# EAGLE design BMSV1.0 (EAGLE 9.1.3)

## Sheet 1 of 3
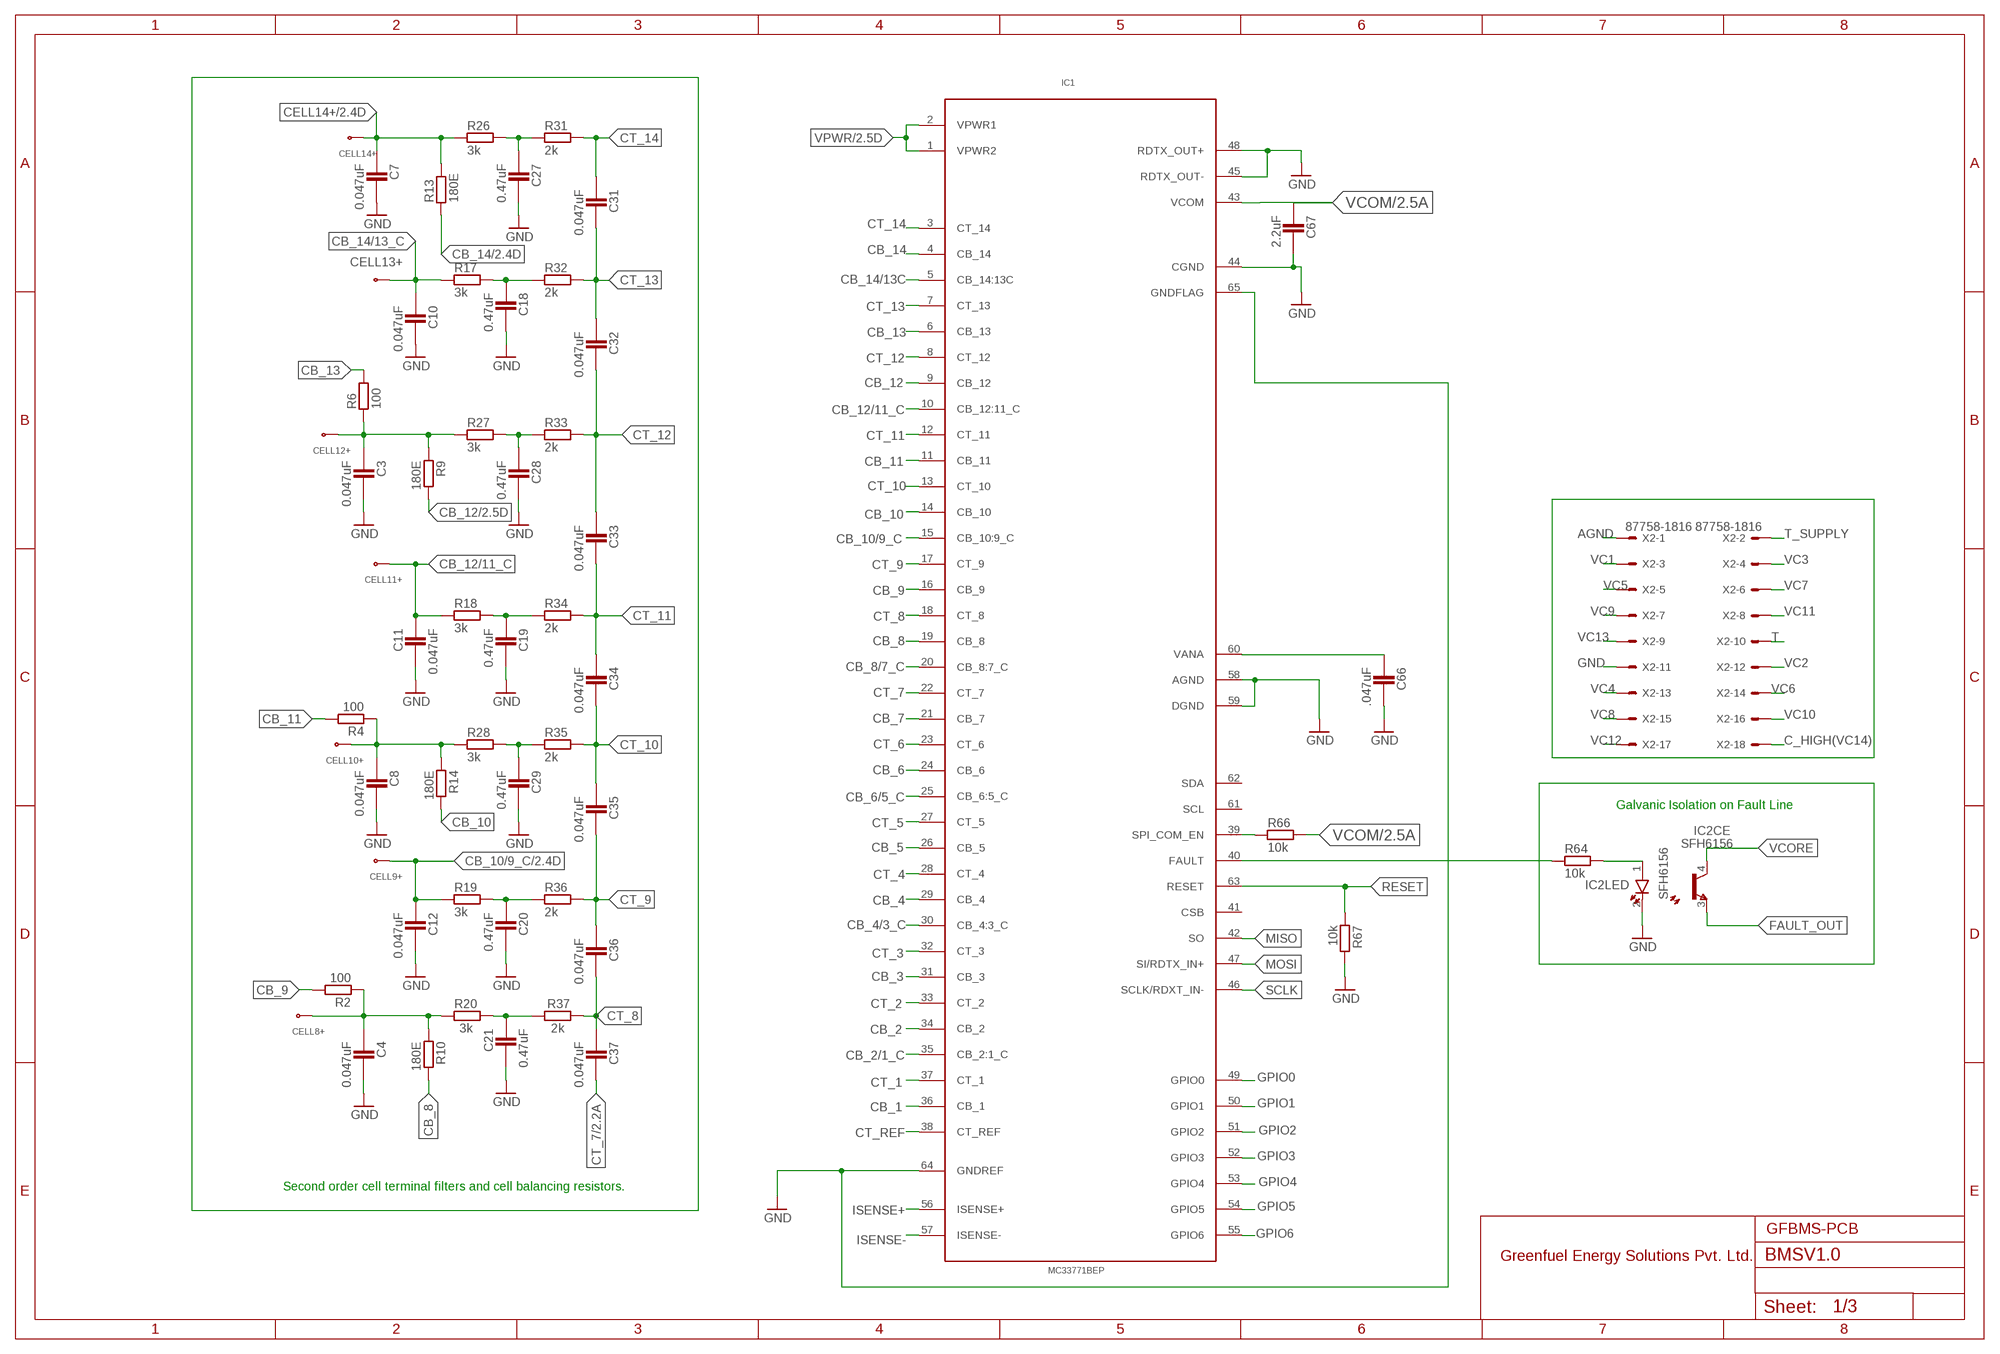
[diagram p0: schematic, sheet 1]

### Parts
C3  0.047uF  CAPACITOR_0402  [CAPC1005X60N]
C4  0.047uF  CAPACITOR_0402  [CAPC1005X60N]
C7  0.047uF  CAPACITOR_0402  [CAPC1005X60N]
C8  0.047uF  CAPACITOR_0402  [CAPC1005X60N]
C10  0.047uF  CAPACITOR_0402  [CAPC1005X60N]
C11  0.047uF  CAPACITOR_0402  [CAPC1005X60N]
C12  0.047uF  CAPACITOR_0402  [CAPC1005X60N]
C18  0.47uF  CAPACITOR_0402  [CAPC1005X60N]
C19  0.47uF  CAPACITOR_0402  [CAPC1005X60N]
C20  0.47uF  CAPACITOR_0402  [CAPC1005X60N]
C21  0.47uF  CAPACITOR_0402  [CAPC1005X60N]
C27  0.47uF  CAPACITOR_0402  [CAPC1005X60N]
C28  0.47uF  CAPACITOR_0402  [CAPC1005X60N]
C29  0.47uF  CAPACITOR_0402  [CAPC1005X60N]
C31  0.047uF  CAPACITOR_0402  [CAPC1005X60N]
C32  0.047uF  CAPACITOR_0402  [CAPC1005X60N]
C33  0.047uF  CAPACITOR_0402  [CAPC1005X60N]
C34  0.047uF  CAPACITOR_0402  [CAPC1005X60N]
C35  0.047uF  CAPACITOR_0402  [CAPC1005X60N]
C36  0.047uF  CAPACITOR_0402  [CAPC1005X60N]
C37  0.047uF  CAPACITOR_0402  [CAPC1005X60N]
C66  .047uF  CAPACITOR_0402  [CAPC1005X60N]
C67  2.2uF  CAPACITOR_0402  [CAPC1005X60N]
CELL8+  GF_BMS_CELL_PADP_PAD  [CELL_PAD]
CELL9+  GF_BMS_CELL_PADP_PAD  [CELL_PAD]
CELL10+  GF_BMS_CELL_PADP_PAD  [CELL_PAD]
CELL11+  GF_BMS_CELL_PADP_PAD  [CELL_PAD]
CELL12+  GF_BMS_CELL_PADP_PAD  [CELL_PAD]
CELL13+  GF_BMS_CELL_PADP_PAD  [CELL_PAD]
CELL14+  GF_BMS_CELL_PADP_PAD  [CELL_PAD]
IC1  MC33771BEP  [64PIN-LQFP]
IC2  SFH6156  [SFH]
R2  100  RESISTOR_0402  [RESC1005X40AN]
R4  100  RESISTOR_0402  [RESC1005X40AN]
R6  100  RESISTOR_0402  [RESC1005X40AN]
R9  180E  RESISTOR_0402  [RESC1005X40AN]
R10  180E  RESISTOR_0402  [RESC1005X40AN]
R13  180E  RESISTOR_0402  [RESC1005X40AN]
R14  180E  RESISTOR_0402  [RESC1005X40AN]
R17  3k  RESISTOR_0402  [RESC1005X40AN]
R18  3k  RESISTOR_0402  [RESC1005X40AN]
R19  3k  RESISTOR_0402  [RESC1005X40AN]
R20  3k  RESISTOR_0402  [RESC1005X40AN]
R26  3k  RESISTOR_0402  [RESC1005X40AN]
R27  3k  RESISTOR_0402  [RESC1005X40AN]
R28  3k  RESISTOR_0402  [RESC1005X40AN]
R31  2k  RESISTOR_0402  [RESC1005X40AN]
R32  2k  RESISTOR_0402  [RESC1005X40AN]
R33  2k  RESISTOR_0402  [RESC1005X40AN]
R34  2k  RESISTOR_0402  [RESC1005X40AN]
R35  2k  RESISTOR_0402  [RESC1005X40AN]
R36  2k  RESISTOR_0402  [RESC1005X40AN]
R37  2k  RESISTOR_0402  [RESC1005X40AN]
R64  10k  RESISTOR_0402  [RESC1005X40AN]
R66  10k  RESISTOR_0402  [RESC1005X40AN]
R67  10k  RESISTOR_0402  [RESC1005X40AN]
X2  87758-1816  [87758-1816]

### Nets
AGND: X2.1
C_HIGH(VC14): X2.18
CB_1: IC1.36(CB_1) ; also sheet 2
CB_2: IC1.34(CB_2) ; also sheet 2
CB_2/1_C: IC1.35(CB_2:1_C) ; also sheet 2
CB_3: IC1.31(CB_3) ; also sheet 2
CB_4: IC1.29(CB_4) ; also sheet 2
CB_4/3_C: IC1.30(CB_4:3_C) ; also sheet 2
CB_5: IC1.26(CB_5) ; also sheet 2
CB_6: IC1.24(CB_6) ; also sheet 2
CB_6/5_C: IC1.25(CB_6:5_C) ; also sheet 2
CB_7: IC1.21(CB_7) ; also sheet 2
CB_8: IC1.19(CB_8) R10.2
CB_8/7_C: IC1.20(CB_8:7_C) ; also sheet 2
CB_9: IC1.16(CB_9) R2.2
CB_10: IC1.14(CB_10) R14.2
CB_10/9_C: C12.1 CELL9+.P$1(S) IC1.15(CB_10:9_C) R19.1 ; also sheet 2
CB_11: IC1.11(CB_11) R4.2
CB_12: IC1.9(CB_12) R9.2 ; also sheet 2
CB_12/11_C: C11.1 CELL11+.P$1(S) IC1.10(CB_12:11_C) R18.1
CB_13: IC1.6(CB_13) R6.2
CB_13/12_C: C3.1 CELL12+.P$1(S) R6.1 R9.1 R27.1
CB_13/12_C1: C8.1 CELL10+.P$1(S) R4.1 R14.1 R28.1
CB_13/12_C2: C4.1 CELL8+.P$1(S) R2.1 R10.1 R20.1
CB_14: IC1.4(CB_14) R13.1 ; also sheet 2
CB_14/13_C: C10.1 CELL13+.P$1(S) R17.1
CB_14/13C: IC1.5(CB_14:13C)
CELL14+: C7.1 CELL14+.P$1(S) R13.2 R26.1 ; also sheet 2
CT_1: IC1.37(CT_1) ; also sheet 2
CT_2: IC1.33(CT_2) ; also sheet 2
CT_3: IC1.32(CT_3) ; also sheet 2
CT_4: IC1.28(CT_4) ; also sheet 2
CT_5: IC1.27(CT_5) ; also sheet 2
CT_6: IC1.23(CT_6) ; also sheet 2
CT_7: C37.2 IC1.22(CT_7) ; also sheet 2
CT_8: C36.2 C37.1 IC1.18(CT_8) R37.2
CT_9: C35.2 C36.1 IC1.17(CT_9) R36.2
CT_10: C34.2 C35.1 IC1.13(CT_10) R35.2
CT_11: C33.2 C34.1 IC1.12(CT_11) R34.2
CT_12: C32.2 C33.1 IC1.8(CT_12) R33.2
CT_13: C31.2 C32.1 IC1.7(CT_13) R32.2
CT_14: C31.1 IC1.3(CT_14) R31.2
CT_REF: IC1.38(CT_REF) ; also sheet 2
FAULT_OUT: IC2.3(CE:E)
GND: C3.2 C4.2 C7.2 C8.2 C10.2 C11.2 C12.2 C18.2 C19.2 C20.2 C21.2 C27.2 C28.2 C29.2 C66.2 C67.2 IC1.44(CGND) IC1.45(RDTX_OUT-) IC1.48(RDTX_OUT+) IC1.58(AGND) IC1.59(DGND) IC1.64(GNDREF) IC1.65(GNDFLAG) IC2.2(LED:K) R67.2 X2.11 ; also sheet 2,3
GPIO0: IC1.49(GPIO0) ; also sheet 2
GPIO1: IC1.50(GPIO1) ; also sheet 2
GPIO2: IC1.51(GPIO2) ; also sheet 2
GPIO3: IC1.52(GPIO3) ; also sheet 2
GPIO4: IC1.53(GPIO4) ; also sheet 2
GPIO5: IC1.54(GPIO5) ; also sheet 2
GPIO6: IC1.55(GPIO6) ; also sheet 2
ISENSE+: IC1.56(ISENSE+) ; also sheet 2
ISENSE-: IC1.57(ISENSE-) ; also sheet 2
MISO: IC1.42(SO)
MOSI: IC1.47(SI/RDTX_IN+)
N$1: C27.1 R26.2 R31.1
N$2: C21.1 R20.2 R37.1
N$4: C29.1 R28.2 R35.1
N$5: C28.1 R27.2 R33.1
N$6: C18.1 R17.2 R32.1
N$7: C20.1 R19.2 R36.1
N$9: C19.1 R18.2 R34.1
N$26: C66.1 IC1.60(VANA)
N$30: IC1.40(FAULT) R64.1
N$31: IC2.1(LED:A) R64.2
N$34: IC1.39(SPI_COM_EN) R66.1
RESET: IC1.63(RESET) R67.1
SCLK: IC1.46(SCLK/RDXT_IN-)
T: X2.10
T_SUPPLY: X2.2
VC1: X2.3
VC2: X2.12
VC3: X2.4
VC4: X2.13
VC5: X2.5
VC6: X2.14
VC7: X2.6
VC8: X2.15
VC9: X2.7
VC10: X2.16
VC11: X2.8
VC12: X2.17
VC13: X2.9
VCOM: C67.1 IC1.43(VCOM) R66.2 ; also sheet 2
VCORE: IC2.4(CE:C)
VPWR: IC1.1(VPWR2) IC1.2(VPWR1) ; also sheet 2
Unconnected: IC1.41(CSB) IC1.61(SCL) IC1.62(SDA)

### Notes on the sheet
- Galvanic Isolation on Fault Line
- Second order cell terminal filters and cell balancing resistors.
- GFBMS-PCB
- Greenfuel Energy Solutions Pvt. Ltd.

## Sheet 2 of 3
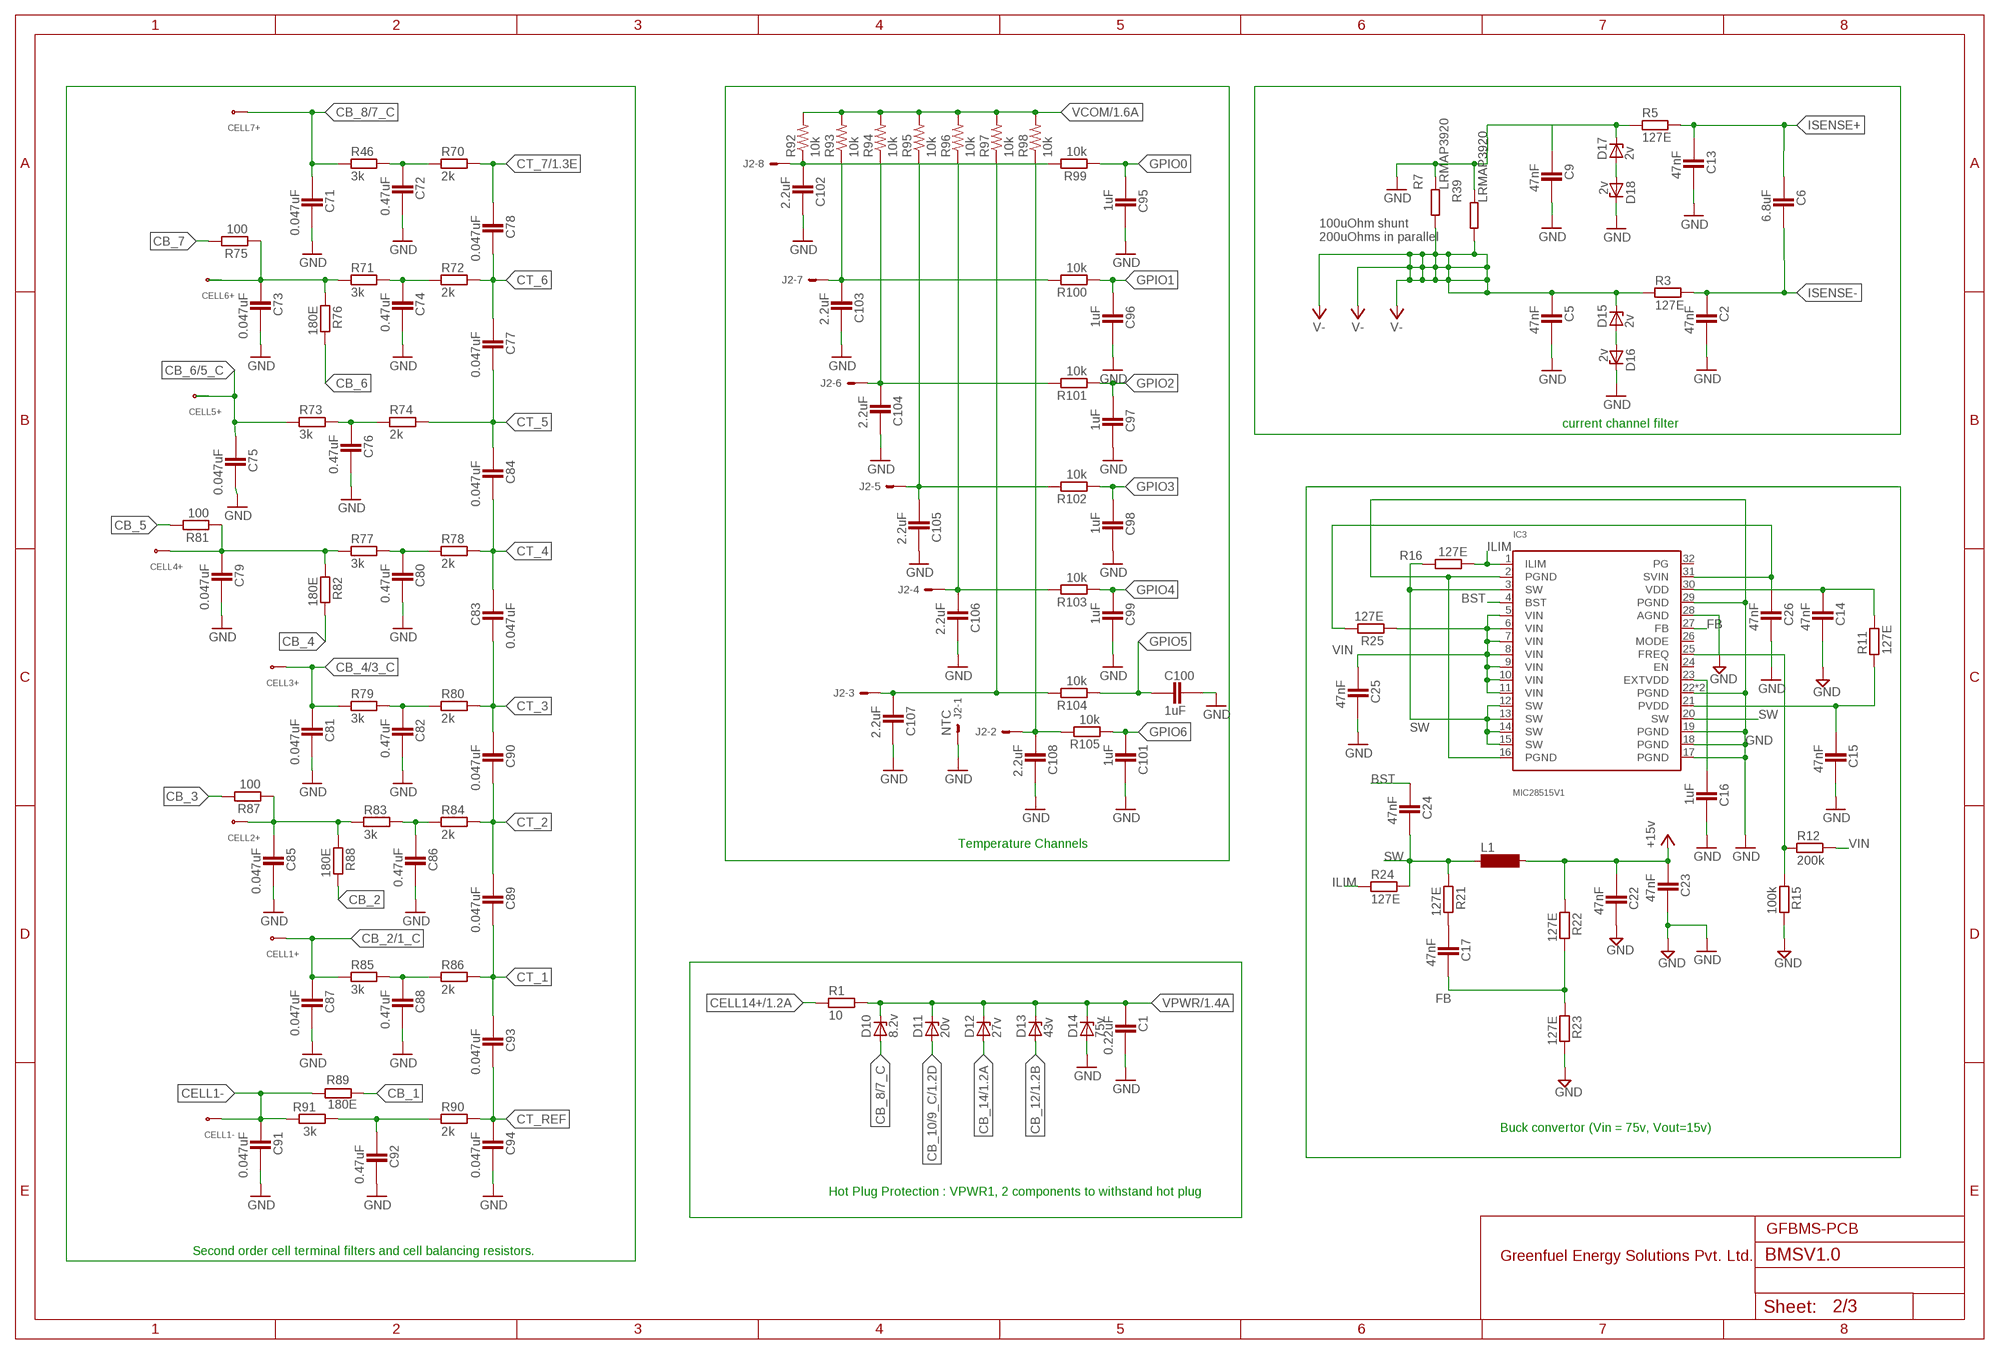
[diagram p1: schematic, sheet 2]

### Parts
C1  0.22uF  CAPACITOR_0402  [CAPC1005X60N]
C2  47nF  CAPACITOR_0402  [CAPC1005X60N]
C5  47nF  CAPACITOR_0402  [CAPC1005X60N]
C6  6.8uF  CAPACITOR_0402  [CAPC1005X60N]
C9  47nF  CAPACITOR_0402  [CAPC1005X60N]
C13  47nF  CAPACITOR_0402  [CAPC1005X60N]
C14  47nF  CAPACITOR_0402  [CAPC1005X60N]
C15  47nF  CAPACITOR_0402  [CAPC1005X60N]
C16  1uF  CAPACITOR_0402  [CAPC1005X60N]
C17  47nF  CAPACITOR_0402  [CAPC1005X60N]
C22  47nF  CAPACITOR_0402  [CAPC1005X60N]
C23  47nF  CAPACITOR_0402  [CAPC1005X60N]
C24  47nF  CAPACITOR_0402  [CAPC1005X60N]
C25  47nF  CAPACITOR_0402  [CAPC1005X60N]
C26  47nF  CAPACITOR_0402  [CAPC1005X60N]
C71  0.047uF  CAPACITOR_0402  [CAPC1005X60N]
C72  0.47uF  CAPACITOR_0402  [CAPC1005X60N]
C73  0.047uF  CAPACITOR_0402  [CAPC1005X60N]
C74  0.47uF  CAPACITOR_0402  [CAPC1005X60N]
C75  0.047uF  CAPACITOR_0402  [CAPC1005X60N]
C76  0.47uF  CAPACITOR_0402  [CAPC1005X60N]
C77  0.047uF  CAPACITOR_0402  [CAPC1005X60N]
C78  0.047uF  CAPACITOR_0402  [CAPC1005X60N]
C79  0.047uF  CAPACITOR_0402  [CAPC1005X60N]
C80  0.47uF  CAPACITOR_0402  [CAPC1005X60N]
C81  0.047uF  CAPACITOR_0402  [CAPC1005X60N]
C82  0.47uF  CAPACITOR_0402  [CAPC1005X60N]
C83  0.047uF  CAPACITOR_0402  [CAPC1005X60N]
C84  0.047uF  CAPACITOR_0402  [CAPC1005X60N]
C85  0.047uF  CAPACITOR_0402  [CAPC1005X60N]
C86  0.47uF  CAPACITOR_0402  [CAPC1005X60N]
C87  0.047uF  CAPACITOR_0402  [CAPC1005X60N]
C88  0.47uF  CAPACITOR_0402  [CAPC1005X60N]
C89  0.047uF  CAPACITOR_0402  [CAPC1005X60N]
C90  0.047uF  CAPACITOR_0402  [CAPC1005X60N]
C91  0.047uF  CAPACITOR_0402  [CAPC1005X60N]
C92  0.47uF  CAPACITOR_0402  [CAPC1005X60N]
C93  0.047uF  CAPACITOR_0402  [CAPC1005X60N]
C94  0.047uF  CAPACITOR_0402  [CAPC1005X60N]
C95  1uF  CAPACITOR_0402  [CAPC1005X60N]
C96  1uF  CAPACITOR_0402  [CAPC1005X60N]
C97  1uF  CAPACITOR_0402  [CAPC1005X60N]
C98  1uF  CAPACITOR_0402  [CAPC1005X60N]
C99  1uF  CAPACITOR_0402  [CAPC1005X60N]
C100  1uF  CAPACITOR_0402  [CAPC1005X60N]
C101  1uF  CAPACITOR_0402  [CAPC1005X60N]
C102  2.2uF  CAPACITOR_0402  [CAPC1005X60N]
C103  2.2uF  CAPACITOR_0402  [CAPC1005X60N]
C104  2.2uF  CAPACITOR_0402  [CAPC1005X60N]
C105  2.2uF  CAPACITOR_0402  [CAPC1005X60N]
C106  2.2uF  CAPACITOR_0402  [CAPC1005X60N]
C107  2.2uF  CAPACITOR_0402  [CAPC1005X60N]
C108  2.2uF  CAPACITOR_0402  [CAPC1005X60N]
CELL1+  GF_BMS_CELL_PADP_PAD  [CELL_PAD]
CELL1-  GF_BMS_CELL_PADP_PAD  [CELL_PAD]
CELL2+  GF_BMS_CELL_PADP_PAD  [CELL_PAD]
CELL3+  GF_BMS_CELL_PADP_PAD  [CELL_PAD]
CELL4+  GF_BMS_CELL_PADP_PAD  [CELL_PAD]
CELL5+  GF_BMS_CELL_PADP_PAD  [CELL_PAD]
CELL6+  GF_BMS_CELL_PADP_PAD  [CELL_PAD]
CELL7+  GF_BMS_CELL_PADP_PAD  [CELL_PAD]
D10  8.2v  ZENER-DIODESOD80C  [SOD80C]
D11  20v  ZENER-DIODESOD80C  [SOD80C]
D12  27v  ZENER-DIODESOD80C  [SOD80C]
D13  43v  ZENER-DIODESOD80C  [SOD80C]
D14  75v  ZENER-DIODESOD80C  [SOD80C]
D15  2v  ZENER-DIODESOD80C  [SOD80C]
D16  2v  ZENER-DIODESOD80C  [SOD80C]
D17  2v  ZENER-DIODESOD80C  [SOD80C]
D18  2v  ZENER-DIODESOD80C  [SOD80C]
IC3  MIC28515V1  [VQFN-32]
J2  NTC  22-27-2081-08  [6410-08]
L1  MS85  [MS85]
R1  10  RESISTOR_0402  [RESC1005X40AN]
R3  127E  RESISTOR_0402  [RESC1005X40AN]
R5  127E  RESISTOR_0402  [RESC1005X40AN]
R7  LRMAP3920  [SMD4]
R11  127E  RESISTOR_0402  [RESC1005X40AN]
R12  200k  RESISTOR_0402  [RESC1005X40AN]
R15  100k  RESISTOR_0402  [RESC1005X40AN]
R16  127E  RESISTOR_0402  [RESC1005X40AN]
R21  127E  RESISTOR_0402  [RESC1005X40AN]
R22  127E  RESISTOR_0402  [RESC1005X40AN]
R23  127E  RESISTOR_0402  [RESC1005X40AN]
R24  127E  RESISTOR_0402  [RESC1005X40AN]
R25  127E  RESISTOR_0402  [RESC1005X40AN]
R39  LRMAP3920  [SMD4]
R46  3k  RESISTOR_0402  [RESC1005X40AN]
R70  2k  RESISTOR_0402  [RESC1005X40AN]
R71  3k  RESISTOR_0402  [RESC1005X40AN]
R72  2k  RESISTOR_0402  [RESC1005X40AN]
R73  3k  RESISTOR_0402  [RESC1005X40AN]
R74  2k  RESISTOR_0402  [RESC1005X40AN]
R75  100  RESISTOR_0402  [RESC1005X40AN]
R76  180E  RESISTOR_0402  [RESC1005X40AN]
R77  3k  RESISTOR_0402  [RESC1005X40AN]
R78  2k  RESISTOR_0402  [RESC1005X40AN]
R79  3k  RESISTOR_0402  [RESC1005X40AN]
R80  2k  RESISTOR_0402  [RESC1005X40AN]
R81  100  RESISTOR_0402  [RESC1005X40AN]
R82  180E  RESISTOR_0402  [RESC1005X40AN]
R83  3k  RESISTOR_0402  [RESC1005X40AN]
R84  2k  RESISTOR_0402  [RESC1005X40AN]
R85  3k  RESISTOR_0402  [RESC1005X40AN]
R86  2k  RESISTOR_0402  [RESC1005X40AN]
R87  100  RESISTOR_0402  [RESC1005X40AN]
R88  180E  RESISTOR_0402  [RESC1005X40AN]
R89  180E  RESISTOR_0402  [RESC1005X40AN]
R90  2k  RESISTOR_0402  [RESC1005X40AN]
R91  3k  RESISTOR_0402  [RESC1005X40AN]
R92  10k  R-US_R0805  [R0805]
R93  10k  R-US_R0805  [R0805]
R94  10k  R-US_R0805  [R0805]
R95  10k  R-US_R0805  [R0805]
R96  10k  R-US_R0805  [R0805]
R97  10k  R-US_R0805  [R0805]
R98  10k  R-US_R0805  [R0805]
R99  10k  RESISTOR_0402  [RESC1005X40AN]
R100  10k  RESISTOR_0402  [RESC1005X40AN]
R101  10k  RESISTOR_0402  [RESC1005X40AN]
R102  10k  RESISTOR_0402  [RESC1005X40AN]
R103  10k  RESISTOR_0402  [RESC1005X40AN]
R104  10k  RESISTOR_0402  [RESC1005X40AN]
R105  10k  RESISTOR_0402  [RESC1005X40AN]

### Nets
BST: C24.1 IC3.4(BST)
CB_1: R89.2 ; also sheet 1
CB_2: R88.2 ; also sheet 1
CB_2/1_C: C87.1 CELL1+.P$1(S) R85.1 ; also sheet 1
CB_3: R87.2 ; also sheet 1
CB_4: R82.2 ; also sheet 1
CB_4/3_C: C81.1 CELL3+.P$1(S) R79.1 ; also sheet 1
CB_5: R81.2 ; also sheet 1
CB_6: R76.2 ; also sheet 1
CB_6/5_C: C75.1 CELL5+.P$1(S) R73.1 ; also sheet 1
CB_7: R75.2 ; also sheet 1
CB_8/7_C: C71.1 CELL7+.P$1(S) D10.A R46.1 ; also sheet 1
CB_10/9_C: D11.A ; also sheet 1
CB_12: D13.A ; also sheet 1
CB_13/12_C6: C73.1 CELL6+.P$1(S) R71.1 R75.1 R76.1
CB_13/12_C7: C79.1 CELL4+.P$1(S) R77.1 R81.1 R82.1
CB_13/12_C8: C85.1 CELL2+.P$1(S) R83.1 R87.1 R88.1
CB_14: D12.A ; also sheet 1
CELL1-: C91.1 CELL1-.P$1(S) R89.1 R91.1
CELL14+: R1.1 ; also sheet 1
CT_1: C89.2 C93.1 R86.2 ; also sheet 1
CT_2: C89.1 C90.2 R84.2 ; also sheet 1
CT_3: C83.2 C90.1 R80.2 ; also sheet 1
CT_4: C83.1 C84.2 R78.2 ; also sheet 1
CT_5: C77.2 C84.1 R74.2 ; also sheet 1
CT_6: C77.1 C78.2 R72.2 ; also sheet 1
CT_7: C78.1 R70.2 ; also sheet 1
CT_REF: C93.2 C94.1 R90.2 ; also sheet 1
FB: C17.2 IC3.27(FB) R22.2 R23.1
GND: C1.2 C2.2 C5.2 C9.1 C9.2 C13.2 C14.2 C15.2 C16.2 C22.2 C23.2 C25.2 C26.2 C71.2 C72.2 C73.2 C74.2 C75.2 C76.2 C79.2 C80.2 C81.2 C82.2 C85.2 C86.2 C87.2 C88.2 C91.2 C92.2 C94.2 C95.2 C96.2 C97.2 C98.2 C99.2 C100.2 C101.2 C102.2 C103.2 C104.2 C105.2 C106.2 C107.2 C108.2 D14.A D16.C D18.C IC3.2(PGND) IC3.16(PGND) IC3.17(PGND) IC3.18(PGND) IC3.19(PGND) IC3.22(PGND) IC3.28(AGND) IC3.29(PGND) IC3.33(PGND) J2.1 R7.P$2 R15.2 R23.2 R39.P$2 ; also sheet 1,3
GPIO0: C95.1 R99.1 ; also sheet 1
GPIO1: C96.1 R100.1 ; also sheet 1
GPIO2: C97.1 R101.1 ; also sheet 1
GPIO3: C98.1 R102.1 ; also sheet 1
GPIO4: C99.1 R103.1 ; also sheet 1
GPIO5: C100.1 R104.1 ; also sheet 1
GPIO6: C101.1 R105.1 ; also sheet 1
ILIM: IC3.1(ILIM) R16.1 R24.1
ISENSE+: C6.1 C13.1 R5.2 ; also sheet 1
ISENSE-: C2.1 C6.2 R3.2 ; also sheet 1
N$3: D15.A D16.A
N$8: C76.1 R73.2 R74.1
N$10: C14.1 IC3.30(VDD) R11.2
N$11: D17.A D18.A
N$15: D17.C R5.1
N$16: C15.1 IC3.21(PVDD) R11.1
N$17: IC3.25(FREQ) R12.1 R15.1
N$18: C16.1 IC3.23(EXTVDD)
N$21: C26.1 IC3.31(SVIN) R25.2
N$24: C17.1 R21.2
N$41: C72.1 R46.2 R70.1
N$42: C74.1 R71.2 R72.1
N$44: C80.1 R77.2 R78.1
N$45: C82.1 R79.2 R80.1
N$46: C86.1 R83.2 R84.1
N$47: C88.1 R85.2 R86.1
N$48: C92.1 R90.1 R91.2
N$49: C102.1 J2.8 R92.1 R99.2
N$50: C103.1 J2.7 R93.1 R100.2
N$51: C104.1 J2.6 R94.1 R101.2
N$52: C105.1 J2.5 R95.1 R102.2
N$53: C106.1 J2.4 R96.1 R103.2
N$54: C107.1 J2.3 R97.1 R104.2
N$55: C108.1 J2.2 R98.1 R105.2
SW: C24.2 IC3.3(SW) IC3.12(SW) IC3.13(SW) IC3.14(SW) IC3.15(SW) IC3.20(SW) L1.1 R16.2 R21.1 R24.2
V-: C5.1 D15.C R3.1 R7.P$1 R39.P$1
VCC: C22.1 C23.1 L1.2 R22.1 ; supply symbol labelled +15v
VCOM: R92.2 R93.2 R94.2 R95.2 R96.2 R97.2 R98.2 ; also sheet 1
VIN: C25.1 IC3.5(VIN) IC3.6(VIN) IC3.7(VIN) IC3.8(VIN) IC3.9(VIN) IC3.10(VIN) IC3.11(VIN) R12.2 R25.1
VPWR: C1.1 D10.C D11.C D12.C D13.C D14.C R1.2 ; also sheet 1
Unconnected: IC3.24(EN) IC3.26(MODE) IC3.32(PG)

### Notes on the sheet
- 100uOhm shunt 
  200uOhms in parallel
- current channel filter
- Temperature Channels
- Buck convertor (Vin = 75v, Vout=15v)
- Hot Plug Protection : VPWR1, 2 components to withstand hot plug
- GFBMS-PCB
- Second order cell terminal filters and cell balancing resistors.
- Greenfuel Energy Solutions Pvt. Ltd.

## Sheet 3 of 3
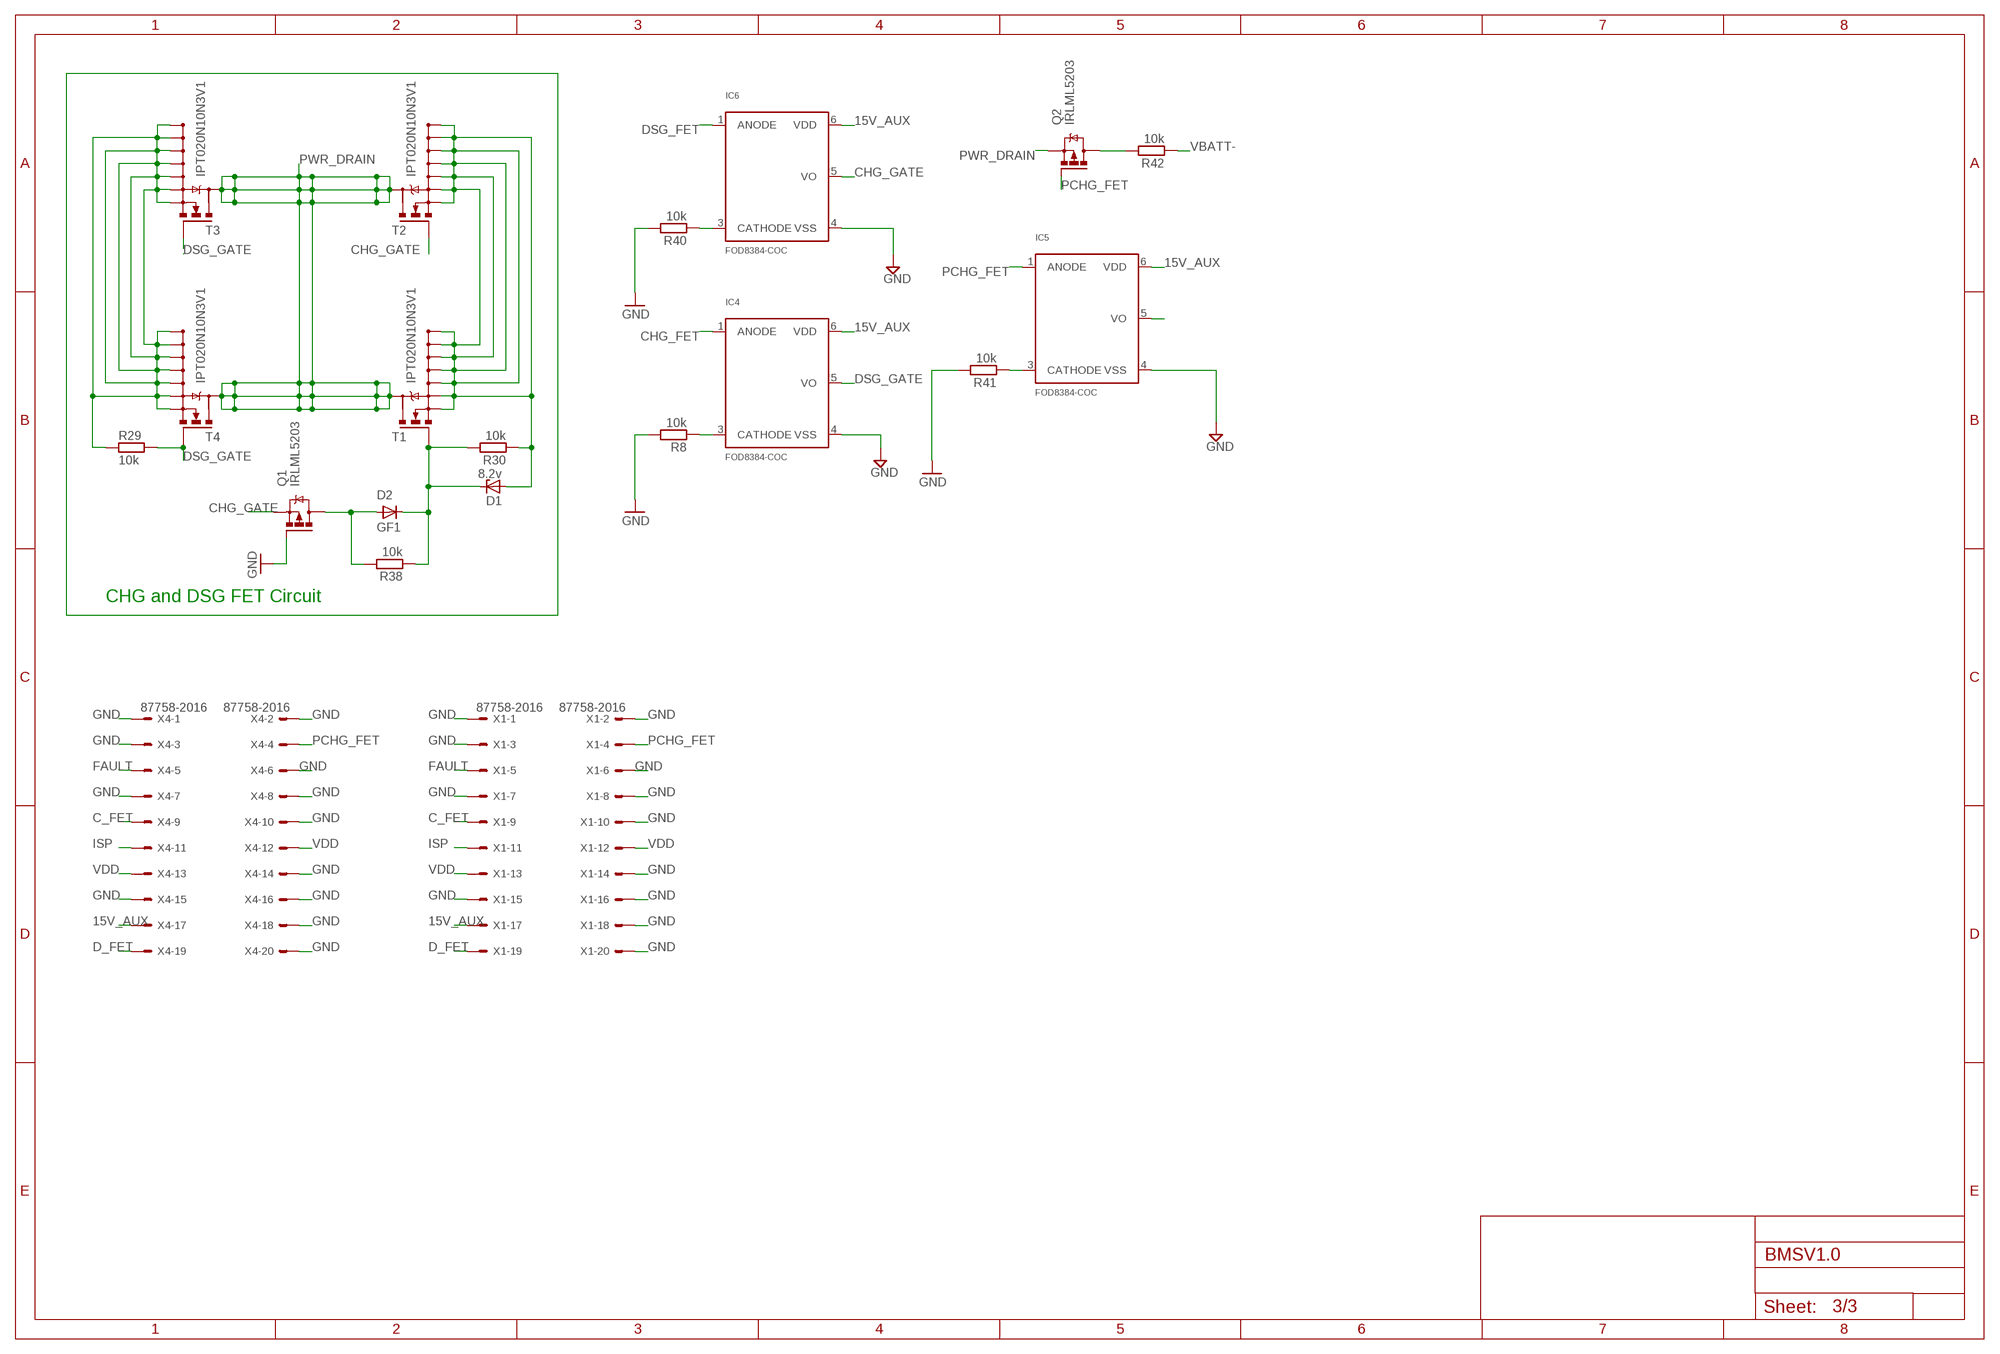
[diagram p2: schematic, sheet 3]

### Parts
D1  8.2v  ZENER-DIODESOD80C  [SOD80C]
D2  GF1  [SMA-DO214AC]
IC4  FOD8384-COC  [SOP5]
IC5  FOD8384-COC  [SOP5]
IC6  FOD8384-COC  [SOP5]
Q1  IRLML5203  [MICRO3]
Q2  IRLML5203  [MICRO3]
R8  10k  RESISTOR_0402  [RESC1005X40AN]
R29  10k  RESISTOR_0402  [RESC1005X40AN]
R30  10k  RESISTOR_0402  [RESC1005X40AN]
R38  10k  RESISTOR_0402  [RESC1005X40AN]
R40  10k  RESISTOR_0402  [RESC1005X40AN]
R41  10k  RESISTOR_0402  [RESC1005X40AN]
R42  10k  RESISTOR_0402  [RESC1005X40AN]
T1  IPT020N10N3V1  [PG-HSOF-9]
T2  IPT020N10N3V1  [PG-HSOF-9]
T3  IPT020N10N3V1  [PG-HSOF-9]
T4  IPT020N10N3V1  [PG-HSOF-9]
X1  87758-2016  [87758-2016]
X4  87758-2016  [87758-2016]

### Nets
15V_AUX: IC4.6(VDD) IC5.6(VDD) IC6.6(VDD) X1.17 X4.17
C_FET: X1.9 X4.9
CHG_FET: IC4.1(ANODE)
CHG_GATE: IC6.5(VO) Q1.2(S) T2.1(G)
D_FET: X1.19 X4.19
DSG_FET: IC6.1(ANODE)
DSG_GATE: IC4.5(VO) R29.2 T3.1(G) T4.1(G)
FAULT: X1.5 X4.5
GND: IC4.4(VSS) IC5.4(VSS) IC6.4(VSS) Q1.1(G) R8.2 R40.2 R41.2 X1.1 X1.2 X1.3 X1.6 X1.7 X1.8 X1.10 X1.14 X1.15 X1.16 X1.18 X1.20 X4.1 X4.2 X4.3 X4.6 X4.7 X4.8 X4.10 X4.14 X4.15 X4.16 X4.18 X4.20 ; also sheet 1,2
ISP: X1.11 X4.11
N$19: D2.A Q1.3(D) R38.2
N$20: IC4.3(CATHODE) R8.1
N$23: D1.C D2.K(C) R30.2 R38.1 T1.1(G)
N$25: IC6.3(CATHODE) R40.1
N$27: IC5.3(CATHODE) R41.1
N$28: Q2.3(D) R42.2
N$38: IC5.5(VO)
N$61: R29.1 T3.2(S) T3.3(S1) T3.4(S2) T3.5(S3) T3.6(S4) T3.7(S5) T3.8(S6) T4.2(S) T4.3(S1) T4.4(S2) T4.5(S3) T4.6(S4) T4.7(S5) T4.8(S6)
N$67: D1.A R30.1 T1.2(S) T1.3(S1) T1.4(S2) T1.5(S3) T1.6(S4) T1.7(S5) T1.8(S6) T2.2(S) T2.3(S1) T2.4(S2) T2.5(S3) T2.6(S4) T2.7(S5) T2.8(S6)
PCHG_FET: IC5.1(ANODE) Q2.1(G) X1.4 X4.4
PWR_DRAIN: Q2.2(S) T1.9(D) T2.9(D) T3.9(D) T4.9(D)
VBATT-: R42.1
VDD: X1.12 X1.13 X4.12 X4.13

### Notes on the sheet
- CHG and DSG FET Circuit

## Library data of the parts
C1-C29 C31-C37 C66 C67 C71-C108 = ipc-7351-capacitor:CAPACITOR_
CELL1+ CELL1- CELL2+ CELL3+ CELL4+ CELL5+ CELL6+ CELL7+ CELL8+ CELL9+ CELL10+ CELL11+ CELL12+ CELL13+ = GreenFuel:GF_BMS_CELL_PAD
CELL14+ = GreenFuel:GF_BMS_CELL_PAD; SPICEPREFIX: X
D1 D10-D18 = diode:ZENER-DIODE: Z-Diode
D2 = diode:GF1: DIODE
IC1 = GreenFuel:MC33771B: MC33771B - SMARTMOS lithium-ion battery cell controller IC designed for automotive applications, such as hybrid electric (HEV) and electric vehicles (EV) along with industrial applications, such as energy storage systems (ESS) and uninterruptible power supply (UPS) systems. Specification : Type : 64-pin LQFP-EP Manufacture : NXP Manufacture PN: MC33771B-EP Certifications: ISO 26262 Lower limited operating range 7.6 V ≤ VPWR < 9.6 V Supply Voltage : 9.6 V ≤ VPWR ≤ 61.6 V operation, 75 V transient Body Size: 10.00mm x 10.00mm Supporting Material PIC32MX570F512H Datasheet <http://ww1.microchip.com/downloads/en/DeviceDoc/60001290E.pdf>
IC2 = optocoupler:SFH6156: 5.3 kV TRIOS High Reliability Optocoupler; MF: VISHAY/TELEFUNKEN; MPN: SFH6156-4T; OC_FARNELL: 1612479; OC_NEWARK: 21H7733
IC3 = GreenFuel:MIC28515
IC4-IC6 = GreenFuel:FOD8384-C
J2 = con-molex:22-?-08: CONNECTOR wire to board 2.54 mm (.1 inch) pitch header; MF: MOLEX; OC_FARNELL: unknown; OC_NEWARK: unknown
L1 = inductor-neosid:MS85: INDUCTOR SMD power inductor; OC_FARNELL: unknown; OC_NEWARK: unknown
Q1 Q2 = transistor-power:IRLML5203: HEXFET P-Channel Power MOSFET
R1-R6 R8-R38 R40-R42 R46 R64 R66 R67 R70-R91 R99-R105 = ipc-7351-resistor:RESISTOR_
R7 R39 = GreenFuel:LRMAP3920
R92-R98 = adafruit:R-US_: RESISTOR, American symbol
T1-T4 = GreenFuel:IPT020N10N3
X1 X4 = con-molex:87758-2016: 20 Pin - 2mm Dual Row Single Wafer, Vertical T/H HDR Source: http://www.molex.com/pdm_docs/sd/877580616_sd.pdf; MF: MOLEX; MPN: 87758-2016; OC_FARNELL: 7472374; OC_NEWARK: 25M5677
X2 = con-molex:87758-1816: 18 Pin - 2mm Dual Row Single Wafer, Vertical T/H HDR Source: http://www.molex.com/pdm_docs/sd/877580616_sd.pdf; MF: MOLEX; MPN: 87758-1816; OC_FARNELL: unknown; OC_NEWARK: 25M5675

## Board
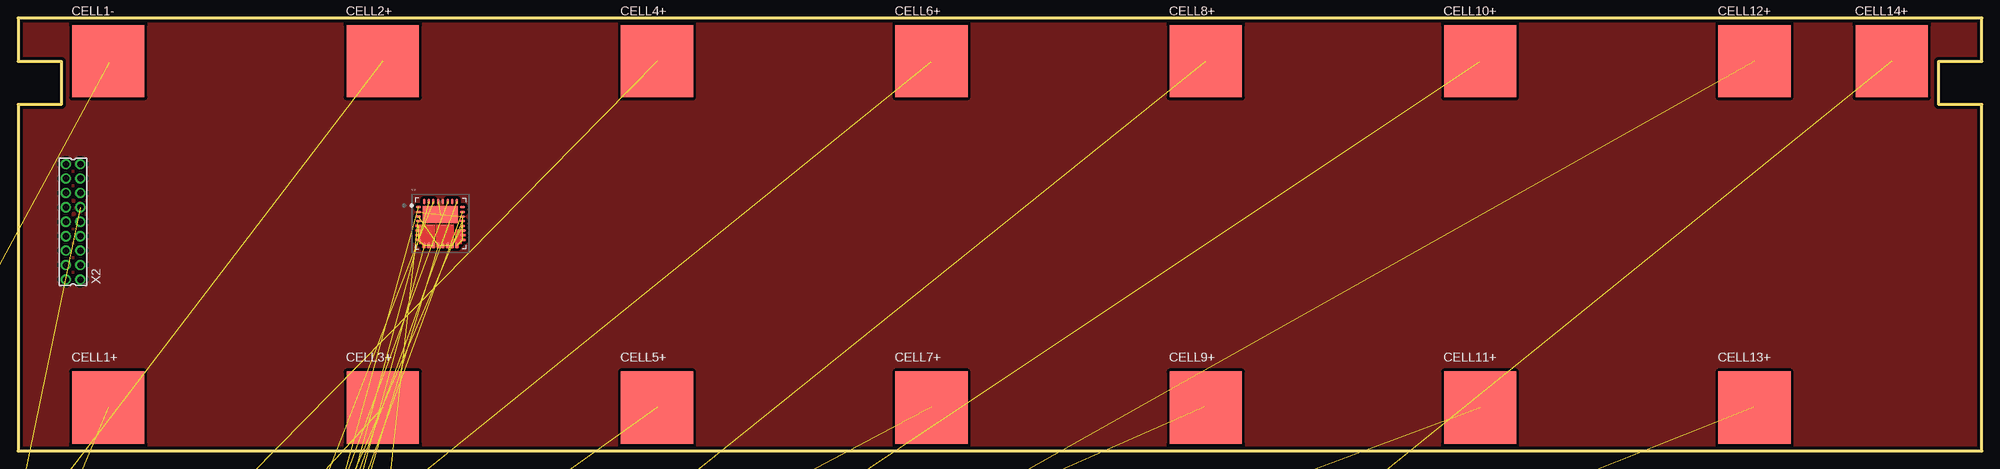
[diagram p3: board, top side]
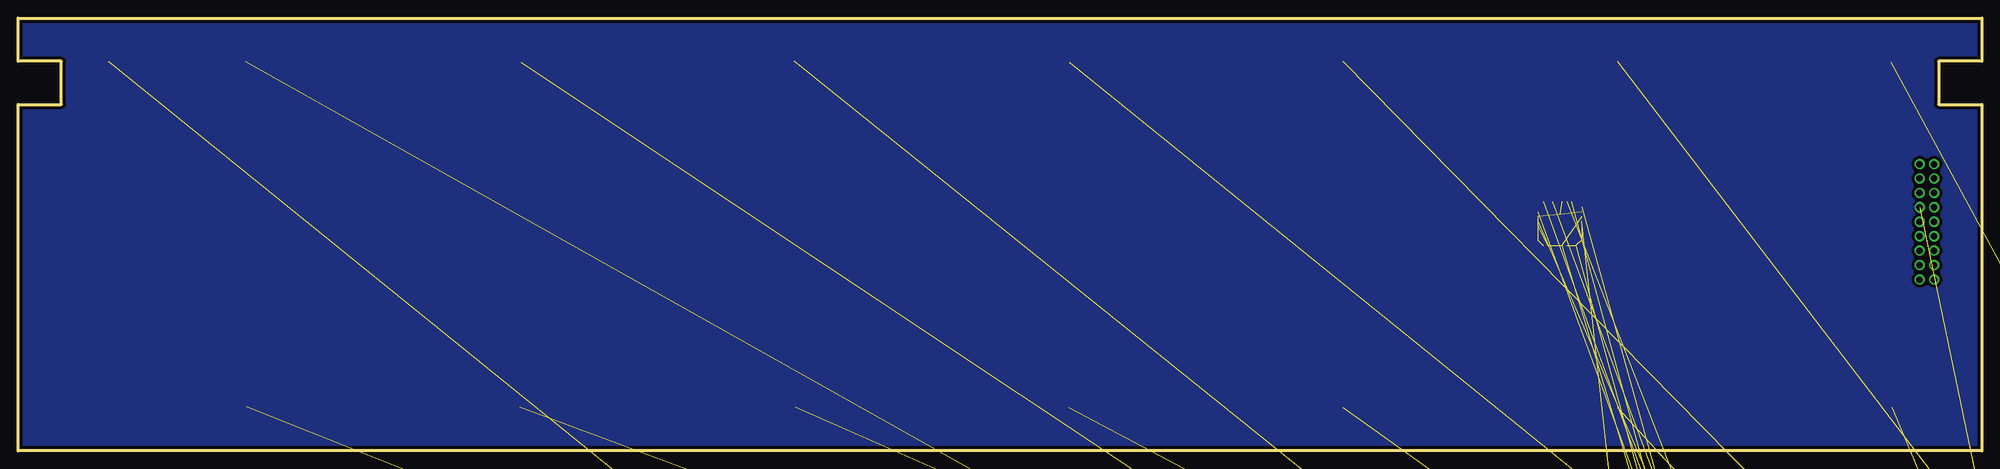
[diagram p4: board, bottom side, seen from below]

Size 272 x 60 mm. Coordinates in mm from the lower left corner, seen from the top.
Outline: 0,0 272,0 272,48 266,48 266,54 272,54 272,60 0,60 0,54 6,54 6,48 0,48 0,0
Copper layers [15:((1+2)*(15+16)):2]: Top 0.035mm / dielectric 0.09238125mm / Route2 0.035mm / dielectric 1.2304mm / Route15 0.035mm / dielectric 0.09238125mm / Bottom 0.035mm
Design rules "default": minimum track width 6mil, minimum drill 12mil, track to track 10mil, track to pad 8mil, pad to pad 6mil, via to via 10mil, smd to smd 0mil, copper to edge 10mil, drill to drill 10mil, minimum pad ring 10mil, minimum via ring 6mil, stop-mask expansion 2mil, vias tented up to drill 100mil, thermal gap 10mil

### Footprints (pad centres in the part's own frame; a part is rotated, then mirrored left to right if it is on the bottom)
CAPC1005X60N = smd 0.65 x 0.65: 1 -0.45,0; 2 0.45,0
CELL_PAD = smd 10 x 10: P$1 0,0
SOD80C = smd 1.4 x 1.8: A 1.7,0; C -1.7,0
SMA-DO214AC = smd 1.8 x 1.7: A -2.05,0; K 2.05,0
64PIN-LQFP = smd 1.55 x 0.3: 1 -5.93,3.75; 2 -5.93,3.25; 3 -5.93,2.75; 4 -5.93,2.25; 5 -5.93,1.75; 6 -5.93,1.25; 7 -5.93,0.75; 8 -5.93,0.25; 9 -5.93,-0.25; 10 -5.93,-0.75; 11 -5.93,-1.25; 12 -5.93,-1.75; 13 -5.93,-2.25; 14 -5.93,-2.75; 15 -5.93,-3.25; 16 -5.93,-3.75; 33 5.93,-3.75; 34 5.93,-3.25; 35 5.93,-2.75; 36 5.93,-2.25; 37 5.93,-1.75; 38 5.93,-1.25; 39 5.93,-0.75; 40 5.93,-0.25; 41 5.93,0.25; 42 5.93,0.75; 43 5.93,1.25; 44 5.93,1.75; 45 5.93,2.25; 46 5.93,2.75; 47 5.93,3.25; 48 5.93,3.75 | smd 0.3 x 1.55: 17 -3.75,-5.93; 18 -3.25,-5.93; 19 -2.75,-5.93; 20 -2.25,-5.93; 21 -1.75,-5.93; 22 -1.25,-5.93; 23 -0.75,-5.93; 24 -0.25,-5.93; 25 0.25,-5.93; 26 0.75,-5.93; 27 1.25,-5.93; 28 1.75,-5.93; 29 2.25,-5.93; 30 2.75,-5.93; 31 3.25,-5.93; 32 3.75,-5.93; 49 3.75,5.93; 50 3.25,5.93; 51 2.75,5.93; 52 2.25,5.93; 53 1.75,5.93; 54 1.25,5.93; 55 0.75,5.963; 56 0.25,5.93; 57 -0.25,5.93; 58 -0.75,5.93; 59 -1.25,5.93; 60 -1.75,5.93; 61 -2.25,5.93; 62 -2.75,5.93; 63 -3.25,5.93; 64 -3.75,5.93 | smd 6.1 x 6.1: 65 0,0
SFH = smd 1.4 x 1.8: 1 1.27,5.08; 2 -1.27,5.08; 3 -1.27,-5.08; 4 1.27,-5.08
VQFN-32 = smd 0.75 x 0.35: 1 -3.05,2.275; 2 -3.05,1.625; 3 -3.05,0.975; 4 -3.05,0.325; 5 -3.05,-0.325; 6 -3.05,-0.975; 7 -3.05,-1.625; 8 -3.05,-2.275; 17 3.05,-2.275; 18 3.05,-1.625; 19 3.05,-0.975; 20 3.05,-0.325; 21 3.05,0.325; 22 3.05,0.975; 23 3.05,1.625; 24 3.05,2.275 | smd 0.35 x 0.75: 9 -2.275,-3.05; 10 -1.625,-3.05; 11 -0.975,-3.05; 12 -0.325,-3.05; 13 0.325,-3.05; 14 0.975,-3.05; 15 1.625,-3.05; 16 2.275,-3.05; 25 2.275,3.05; 26 1.625,3.05; 27 0.975,3.05; 28 0.325,3.05; 29 -0.325,3.05; 30 -0.975,3.05; 31 -1.625,3.05; 32 -2.275,3.05 | smd 4.85 x 2.36: 33 0,1.27
SOP5 = smd 0.6 x 2.05: 1 -1.27,-5.355; 3 1.27,-5.355; 4 1.27,5.355; 5 0,5.355; 6 -1.27,5.355
6410-08 = drill 1.016 long: 1 8.89,0; 2 6.35,0; 3 3.81,0; 4 1.27,0; 5 -1.27,0; 6 -3.81,0; 7 -6.35,0; 8 -8.89,0
MS85 = smd 4.5 x 2.25: 1 0,-3.383; 2 0,3.383
MICRO3 = smd 0.8 x 0.9: 1 -0.95,-1; 2 0.95,-1; 3 0,1
RESC1005X40AN = smd 0.6 x 0.6: 1 -0.45,0; 2 0.45,0
SMD4 = smd 2.7 x 6.2: P$1 -4.15,0; P$2 4.15,0
R0805 = smd 1.1 x 1.4: 1 -1,0; 2 1,0
PG-HSOF-9 = smd 0.8 x 2.8: 1 -4.2,-5.25; 2 -3,-5.25; 3 -1.8,-5.25; 4 -0.6,-5.25; 5 0.6,-5.25; 6 1.8,-5.25; 7 3,-5.25; 8 4.2,-5.25 | smd 10 x 3.7: 9 0,0.5
87758-2016 = drill 0.9 pad 1.27: 1 -9,-1; 2 -9,1; 3 -7,-1; 4 -7,1; 5 -5,-1; 6 -5,1; 7 -3,-1; 8 -3,1; 9 -1,-1; 10 -1,1; 11 1,-1; 12 1,1; 13 3,-1; 14 3,1; 15 5,-1; 16 5,1; 17 7,-1; 18 7,1; 19 9,-1; 20 9,1
87758-1816 = drill 0.9 pad 1.27: 1 -8,-1; 2 -8,1; 3 -6,-1; 4 -6,1; 5 -4,-1; 6 -4,1; 7 -2,-1; 8 -2,1; 9 0,-1; 10 0,1; 11 2,-1; 12 2,1; 13 4,-1; 14 4,1; 15 6,-1; 16 6,1; 17 8,-1; 18 8,1

### Placement (x,y rotation side)
C1  31.75,-126.36 0 top  (outside the outline)
C2  16.51,-132.72 0 top  (outside the outline)
C3  -76.2,-122.56 270 top  (outside the outline)
C4  -75.69,-137.79 270 top  (outside the outline)
C5  -11.43,-132.72 0 top  (outside the outline)
C6  -6.35,-132.72 180 top  (outside the outline)
C7  -72.64,-116.46 270 top  (outside the outline)
C8  -75.18,-131.95 270 top  (outside the outline)
C9  29.21,-132.72 0 top  (outside the outline)
C10  -75.18,-119.25 270 top  (outside the outline)
C11  -73.03,-128.27 270 top  (outside the outline)
C12  -74.04,-133.99 270 top  (outside the outline)
C13  -3.81,-132.72 0 top  (outside the outline)
C14  -1.92,-117.85 90 top  (outside the outline)
C15  -4.21,-117.86 270 top  (outside the outline)
C16  5.34,-121.71 0 top  (outside the outline)
C17  0.01,-117.94 0 top  (outside the outline)
C18  -70.61,-119.25 270 top  (outside the outline)
C19  -70.61,-128.27 270 top  (outside the outline)
C20  -70.48,-135 270 top  (outside the outline)
C21  -70.48,-137.54 270 top  (outside the outline)
C22  7.25,-116.12 0 top  (outside the outline)
C23  2.17,-113.23 0 top  (outside the outline)
C24  38.48,-119.24 180 top  (outside the outline)
C25  -1.57,-128.4 270 top  (outside the outline)
C26  -3.25,-129.16 270 top  (outside the outline)
C27  -70.61,-113.16 90 top  (outside the outline)
C28  -70.48,-122.81 270 top  (outside the outline)
C29  -71.75,-130.68 270 top  (outside the outline)
C31  -68.33,-116.46 270 top  (outside the outline)
C32  -68.33,-120.65 270 top  (outside the outline)
C33  -68.33,-126.11 270 top  (outside the outline)
C34  -68.33,-128.52 270 top  (outside the outline)
C35  -68.33,-130.81 270 top  (outside the outline)
C36  -68.2,-135.13 270 top  (outside the outline)
C37  -68.2,-138.56 270 top  (outside the outline)
C66  -56.01,-116.2 90 top  (outside the outline)
C67  -44.96,-124.71 90 top  (outside the outline)
C71  -87.76,-114.81 270 top  (outside the outline)
C72  -84.58,-116.2 270 top  (outside the outline)
C73  -87.5,-119.76 270 top  (outside the outline)
C74  -84.84,-119.76 270 top  (outside the outline)
C75  -89.15,-123.32 270 top  (outside the outline)
C76  -87.12,-123.32 270 top  (outside the outline)
C77  -82.68,-119.76 270 top  (outside the outline)
C78  -82.68,-116.08 270 top  (outside the outline)
C79  -92.08,-125.09 0 top  (outside the outline)
C80  -85.72,-127.64 90 top  (outside the outline)
C81  -51.56,-137.03 0 top  (outside the outline)
C82  -87.63,-131.44 90 top  (outside the outline)
C83  -52.83,-135.25 0 top  (outside the outline)
C84  -82.55,-123.83 0 top  (outside the outline)
C85  -93.09,-132.21 270 top  (outside the outline)
C86  -48.26,-140.34 0 top  (outside the outline)
C87  -93.34,-134.62 270 top  (outside the outline)
C88  -87.63,-134.62 90 top  (outside the outline)
C89  -81.92,-132.72 90 top  (outside the outline)
C90  -81.92,-127 90 top  (outside the outline)
C91  -92.08,-137.16 90 top  (outside the outline)
C92  -86.36,-136.53 90 top  (outside the outline)
C93  -81.28,-135.89 90 top  (outside the outline)
C94  -25.4,-137.16 0 top  (outside the outline)
C95  -13.34,-118.11 0 top  (outside the outline)
C96  -17.14,-125.09 0 top  (outside the outline)
C97  -15.88,-127 0 top  (outside the outline)
C98  -45.09,-113.03 180 top  (outside the outline)
C99  -12.7,-128.27 90 top  (outside the outline)
C100  -22.86,-128.91 90 top  (outside the outline)
C101  -17.91,-132.84 90 top  (outside the outline)
C102  -34.29,-118.75 0 top  (outside the outline)
C103  -22.23,-120.02 90 top  (outside the outline)
C104  -18.41,-127.89 90 top  (outside the outline)
C105  -15.88,-128.65 180 top  (outside the outline)
C106  -10.79,-124.46 180 top  (outside the outline)
C107  -27.94,-120.02 90 top  (outside the outline)
C108  -20.95,-131.44 90 top  (outside the outline)
CELL1+  12.5,6 0 top
CELL1-  12.5,54 0 top
CELL2+  50.5,54 0 top
CELL3+  50.5,6 0 top
CELL4+  88.5,54 0 top
CELL5+  88.5,6 0 top
CELL6+  126.5,54 0 top
CELL7+  126.5,6 0 top
CELL8+  164.5,54 0 top
CELL9+  164.5,6 0 top
CELL10+  202.5,54 0 top
CELL11+  202.5,6 0 top
CELL12+  240.5,54 0 top
CELL13+  240.5,6 0 top
CELL14+  259.5,54 0 top
D1  132.72,-139.06 90 top  (outside the outline)
D2  135.25,-139.06 270 top  (outside the outline)
D10  6.99,-137.79 270 top  (outside the outline)
D11  21.59,-120.02 0 top  (outside the outline)
D12  -1.91,-137.79 90 top  (outside the outline)
D13  1.91,-137.79 90 top  (outside the outline)
D14  -6.35,-137.79 90 top  (outside the outline)
D15  -9.53,-137.79 90 top  (outside the outline)
D16  -19.05,-137.79 270 top  (outside the outline)
D17  -13.34,-137.79 90 top  (outside the outline)
D18  -16.64,-137.79 270 top  (outside the outline)
IC1  -13.64,-73.03 180 top  (outside the outline)
IC2  -32.38,-127.64 90 top  (outside the outline)
IC3  58.51,31.51 0 top
IC4  74.3,-119.38 0 top  (outside the outline)
IC5  83.82,-118.11 180 top  (outside the outline)
IC6  76.2,-140.34 0 top  (outside the outline)
J2  36.83,-113.67 0 top  (outside the outline)
L1  45.8,-125.27 0 top  (outside the outline)
Q1  109.22,-126.36 0 top  (outside the outline)
Q2  85.72,-135.25 0 top  (outside the outline)
R1  21.59,-139.06 0 top  (outside the outline)
R2  -76.2,-135.76 180 top  (outside the outline)
R3  -8.89,-132.72 180 top  (outside the outline)
R4  -75.56,-130.18 180 top  (outside the outline)
R5  -33.02,-133.99 90 top  (outside the outline)
R6  -74.42,-122.56 90 top  (outside the outline)
R7  136.53,-128.91 90 top  (outside the outline)
R8  4.19,-132.59 0 top  (outside the outline)
R9  -72.9,-123.83 270 top  (outside the outline)
R10  -74.17,-137.54 270 top  (outside the outline)
R11  -2.97,-117.86 270 top  (outside the outline)
R12  5.47,-120.09 0 top  (outside the outline)
R13  -75.06,-114.68 0 top  (outside the outline)
R14  -73.66,-131.95 270 top  (outside the outline)
R15  5.47,-119.11 0 top  (outside the outline)
R16  35.82,-127.78 0 top  (outside the outline)
R17  -72.52,-118.75 0 top  (outside the outline)
R18  -72.52,-126.62 0 top  (outside the outline)
R19  -72.26,-133.48 0 top  (outside the outline)
R20  -72.39,-137.03 0 top  (outside the outline)
R21  -1.9,-114.6 0 top  (outside the outline)
R22  1.54,-117.48 270 top  (outside the outline)
R23  3.31,-118 0 top  (outside the outline)
R24  14.87,-114.16 0 top  (outside the outline)
R25  15.62,-118.39 180 top  (outside the outline)
R26  -72.39,-114.68 0 top  (outside the outline)
R27  -72.39,-122.3 0 top  (outside the outline)
R28  -73.41,-130.18 0 top  (outside the outline)
R29  88.27,-140.97 90 top  (outside the outline)
R30  114.3,-141.1 90 top  (outside the outline)
R31  -68.58,-114.68 0 top  (outside the outline)
R32  -68.83,-118.75 0 top  (outside the outline)
R33  -68.71,-122.94 0 top  (outside the outline)
R34  -70.23,-126.62 0 top  (outside the outline)
R35  -70.1,-130.18 0 top  (outside the outline)
R36  -68.71,-133.48 0 top  (outside the outline)
R37  -68.58,-137.03 0 top  (outside the outline)
R38  137.79,-139.06 90 top  (outside the outline)
R39  147.32,-128.91 90 top  (outside the outline)
R40  77.09,-148.46 180 top  (outside the outline)
R41  4.45,-135.89 0 top  (outside the outline)
R42  83.19,-133.99 0 top  (outside the outline)
R46  -85.98,-114.3 0 top  (outside the outline)
R64  -40.01,-126.36 0 top  (outside the outline)
R66  -43.43,-128.4 0 top  (outside the outline)
R67  -58.17,-116.2 90 top  (outside the outline)
R70  -83.19,-114.3 0 top  (outside the outline)
R71  -85.6,-118.11 0 top  (outside the outline)
R72  -83.19,-118.11 0 top  (outside the outline)
R73  -87.5,-121.79 0 top  (outside the outline)
R74  -85.34,-121.79 0 top  (outside the outline)
R75  -87.88,-118.11 180 top  (outside the outline)
R76  -85.98,-119.76 270 top  (outside the outline)
R77  -87.63,-125.73 0 top  (outside the outline)
R78  -85.09,-125.73 0 top  (outside the outline)
R79  -73.66,-142.88 0 top  (outside the outline)
R80  -85.72,-130.81 0 top  (outside the outline)
R81  -94.61,-125.09 0 top  (outside the outline)
R82  -88.9,-127.64 90 top  (outside the outline)
R83  -90.04,-130.56 0 top  (outside the outline)
R84  -48.26,-139.06 0 top  (outside the outline)
R85  -88.27,-139.06 90 top  (outside the outline)
R86  -85.72,-134.62 0 top  (outside the outline)
R87  -92.71,-130.43 0 top  (outside the outline)
R88  -91.06,-132.33 90 top  (outside the outline)
R89  -90.81,-138.43 270 top  (outside the outline)
R90  -84.45,-136.53 0 top  (outside the outline)
R91  -90.17,-136.53 0 top  (outside the outline)
R92  -33.66,-114.94 90 top  (outside the outline)
R93  -31.11,-114.94 90 top  (outside the outline)
R94  -28.57,-114.94 90 top  (outside the outline)
R95  -25.4,-114.94 90 top  (outside the outline)
R96  -22.86,-114.94 90 top  (outside the outline)
R97  -20.32,-114.94 90 top  (outside the outline)
R98  -17.14,-114.94 90 top  (outside the outline)
R99  -16.51,-118.11 180 top  (outside the outline)
R100  -16.51,-121.28 180 top  (outside the outline)
R101  -20.32,-125.73 90 top  (outside the outline)
R102  -12.06,-121.92 180 top  (outside the outline)
R103  -24.13,-123.19 90 top  (outside the outline)
R104  -13.34,-120.02 0 top  (outside the outline)
R105  -54.23,-117.09 270 top  (outside the outline)
T1  120.9,-135.89 0 top  (outside the outline)
T2  120.02,-116.46 180 top  (outside the outline)
T3  94.61,-116.84 180 top  (outside the outline)
T4  94.61,-135.89 0 top  (outside the outline)
X1  60.33,-134.11 0 top  (outside the outline)
X2  7.62,31.75 90 top
X4  60.33,-118.11 0 top  (outside the outline)

### Tracks (layer width: path | path; a pad name or v marks a point on that pad's centre or on a via)
15V_AUX  (4 unrouted)
BST  (1 unrouted)
C_FET  (1 unrouted)
CB_1  (1 unrouted)
CB_2  (1 unrouted)
CB_2/1_C  (3 unrouted)
CB_3  (1 unrouted)
CB_4  (1 unrouted)
CB_4/3_C  (3 unrouted)
CB_5  (1 unrouted)
CB_6  (1 unrouted)
CB_6/5_C  (3 unrouted)
CB_7  (1 unrouted)
CB_8  (1 unrouted)
CB_8/7_C  (4 unrouted)
CB_9  (1 unrouted)
CB_10  (1 unrouted)
CB_10/9_C  (4 unrouted)
  Top 0.152: 164.39,6.1 CELL9+.P$1
CB_11  (1 unrouted)
CB_12  (2 unrouted)
CB_12/11_C  (3 unrouted)
CB_13  (1 unrouted)
CB_13/12_C  (4 unrouted)
CB_13/12_C1  (4 unrouted)
  Top 0.152: 202.39,53.85 CELL10+.P$1
CB_13/12_C2  (4 unrouted)
CB_13/12_C6  (4 unrouted)
  Top 0.152: 126.39,53.85 CELL6+.P$1
CB_13/12_C7  (4 unrouted)
CB_13/12_C8  (4 unrouted)
CB_14  (2 unrouted)
CB_14/13_C  (2 unrouted)
  Top 0.152: 240.39,6.1 CELL13+.P$1
CELL1-  (3 unrouted)
  Top 0.152: 12.6,53.85 CELL1-.P$1
CELL14+  (4 unrouted)
CHG_GATE  (2 unrouted)
CT_1  (3 unrouted)
CT_2  (3 unrouted)
CT_3  (3 unrouted)
CT_4  (3 unrouted)
CT_5  (3 unrouted)
CT_6  (3 unrouted)
CT_7  (3 unrouted)
CT_8  (3 unrouted)
CT_9  (3 unrouted)
CT_10  (3 unrouted)
CT_11  (3 unrouted)
CT_12  (3 unrouted)
CT_13  (3 unrouted)
CT_14  (2 unrouted)
CT_REF  (3 unrouted)
D_FET  (1 unrouted)
DSG_GATE  (3 unrouted)
FAULT  (1 unrouted)
FB  (3 unrouted)
GND  (115 unrouted)
  pour Top (isolate 0.406, rank 6): 0,0 272,0 272,48 266,48 266,54 272,54 272,60 0,60 0,54 6,54 6,48 0,48
  pour Bottom (isolate 0.406): 0,0 272,0 272,48 266,48 266,54 272,54 272,60 0,60 0,54 6,54 6,48 0,48
  pour Top: 4.32,-118.36 4.45,-118.24 5.59,-118.24 5.71,-118.36 5.71,-118.75 5.59,-118.62 5.08,-118.62 4.45,-118.62 4.32,-118.49
  pour Top: 4.45,-116.84 4.45,-118.75 4.57,-118.62 4.95,-118.62 5.84,-118.62 5.84,-117.47 5.71,-117.35 5.21,-116.84
GPIO0  (2 unrouted)
GPIO1  (2 unrouted)
GPIO2  (2 unrouted)
GPIO3  (2 unrouted)
GPIO4  (2 unrouted)
GPIO5  (2 unrouted)
GPIO6  (2 unrouted)
ILIM  (2 unrouted)
ISENSE+  (3 unrouted)
ISENSE-  (3 unrouted)
ISP  (1 unrouted)
N$1  (2 unrouted)
N$2  (2 unrouted)
N$3  (1 unrouted)
N$4  (2 unrouted)
N$5  (2 unrouted)
N$6  (2 unrouted)
N$7  (2 unrouted)
N$8  (2 unrouted)
N$9  (2 unrouted)
N$10  (2 unrouted)
N$11  (1 unrouted)
N$15  (1 unrouted)
N$16  (2 unrouted)
N$17  (2 unrouted)
N$18  (1 unrouted)
N$19  (2 unrouted)
N$20  (1 unrouted)
N$21  (2 unrouted)
N$23  (4 unrouted)
N$24  (1 unrouted)
N$25  (1 unrouted)
N$26  (1 unrouted)
N$27  (1 unrouted)
N$28  (1 unrouted)
N$30  (1 unrouted)
N$31  (1 unrouted)
N$34  (1 unrouted)
N$41  (2 unrouted)
N$42  (2 unrouted)
N$44  (2 unrouted)
N$45  (2 unrouted)
N$46  (2 unrouted)
N$47  (2 unrouted)
N$48  (2 unrouted)
N$49  (3 unrouted)
N$50  (3 unrouted)
N$51  (3 unrouted)
N$52  (3 unrouted)
N$53  (3 unrouted)
N$54  (3 unrouted)
N$55  (3 unrouted)
N$61  (14 unrouted)
N$67  (15 unrouted)
PCHG_FET  (3 unrouted)
PWR_DRAIN  (4 unrouted)
RESET  (1 unrouted)
SW  (10 unrouted)
V-  (4 unrouted)
VCC  (3 unrouted)
VCOM  (9 unrouted)
VDD  (3 unrouted)
VIN  (9 unrouted)
VPWR  (8 unrouted)